# Altium schematic sheet 00-Main.SchDoc
size A4
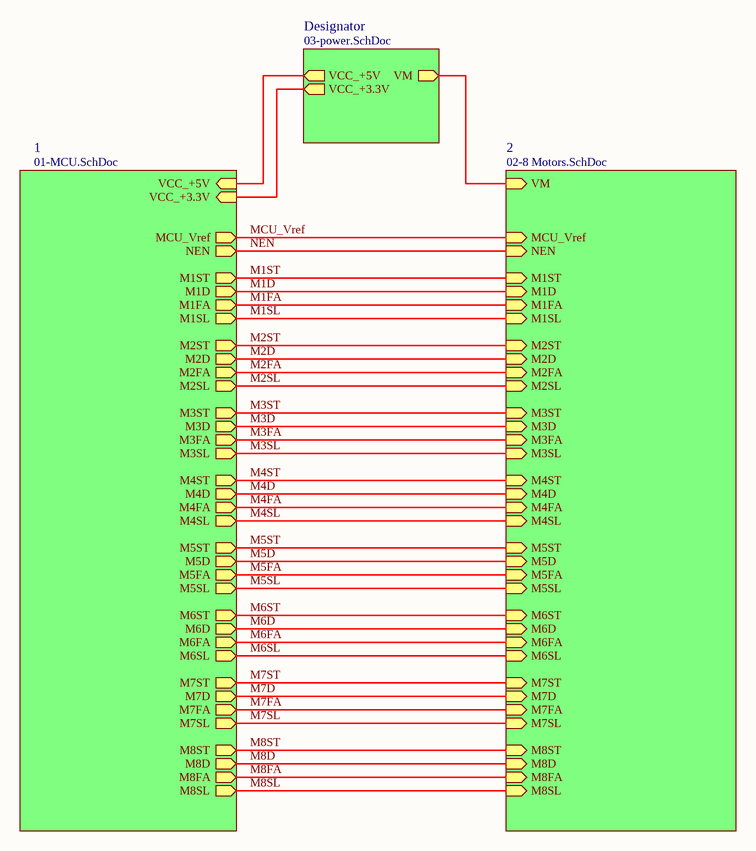
[diagram p0: 00-Main.SchDoc]

## Sub-sheets
1 = 01-MCU.SchDoc: M1ST (out), M1D (out), M1FA (out), M1SL (out), NEN (out), M2ST (out), M2D (out), M2FA (out), M2SL (out), M3ST (out), M3D (out), M3FA (out), M3SL (out), M4ST (out), M4D (out), M4FA (out), M4SL (out), M5ST (out), M5D (out), M5FA (out), M5SL (out), M6ST (out), M6D (out), M6FA (out), M6SL (out), M7ST (out), M7D (out), M7FA (out), M7SL (out), M8ST (out), M8D (out), M8FA (out), M8SL (out), MCU_Vref (out), VCC_+5V (in), VCC_+3.3V (in)
2 = 02-8 Motors.SchDoc: M1ST (in), M1D (in), M1FA (in), M1SL (in), NEN (in), M2ST (in), M2D (in), M2FA (in), M2SL (in), M3ST (in), M3D (in), M3FA (in), M3SL (in), M4ST (in), M4D (in), M4FA (in), M4SL (in), M5ST (in), M5D (in), M5FA (in), M5SL (in), M6ST (in), M6D (in), M6FA (in), M6SL (in), M7ST (in), M7D (in), M7FA (in), M7SL (in), M8ST (in), M8D (in), M8FA (in), M8SL (in), MCU_Vref (in), VM (in)
Designator = 03-power.SchDoc: VCC_+5V (out), VCC_+3.3V (out), VM (out)

## Nets
M1D: sheet 1/M1D, sheet 2/M1D
M1FA: sheet 1/M1FA, sheet 2/M1FA
M1SL: sheet 1/M1SL, sheet 2/M1SL
M1ST: sheet 1/M1ST, sheet 2/M1ST
M2D: sheet 1/M2D, sheet 2/M2D
M2FA: sheet 1/M2FA, sheet 2/M2FA
M2SL: sheet 1/M2SL, sheet 2/M2SL
M2ST: sheet 1/M2ST, sheet 2/M2ST
M3D: sheet 1/M3D, sheet 2/M3D
M3FA: sheet 1/M3FA, sheet 2/M3FA
M3SL: sheet 1/M3SL, sheet 2/M3SL
M3ST: sheet 1/M3ST, sheet 2/M3ST
M4D: sheet 1/M4D, sheet 2/M4D
M4FA: sheet 1/M4FA, sheet 2/M4FA
M4SL: sheet 1/M4SL, sheet 2/M4SL
M4ST: sheet 1/M4ST, sheet 2/M4ST
M5D: sheet 1/M5D, sheet 2/M5D
M5FA: sheet 1/M5FA, sheet 2/M5FA
M5SL: sheet 1/M5SL, sheet 2/M5SL
M5ST: sheet 1/M5ST, sheet 2/M5ST
M6D: sheet 1/M6D, sheet 2/M6D
M6FA: sheet 1/M6FA, sheet 2/M6FA
M6SL: sheet 1/M6SL, sheet 2/M6SL
M6ST: sheet 1/M6ST, sheet 2/M6ST
M7D: sheet 1/M7D, sheet 2/M7D
M7FA: sheet 1/M7FA, sheet 2/M7FA
M7SL: sheet 1/M7SL, sheet 2/M7SL
M7ST: sheet 1/M7ST, sheet 2/M7ST
M8D: sheet 1/M8D, sheet 2/M8D
M8FA: sheet 1/M8FA, sheet 2/M8FA
M8SL: sheet 1/M8SL, sheet 2/M8SL
M8ST: sheet 1/M8ST, sheet 2/M8ST
MCU_Vref: sheet 1/MCU_Vref, sheet 2/MCU_Vref
NEN: sheet 1/NEN, sheet 2/NEN
(unnamed): sheet 1/VCC_+5V, sheet Designator/VCC_+5V
(unnamed): sheet 1/VCC_+3.3V, sheet Designator/VCC_+3.3V
(unnamed): sheet 2/VM, sheet Designator/VM